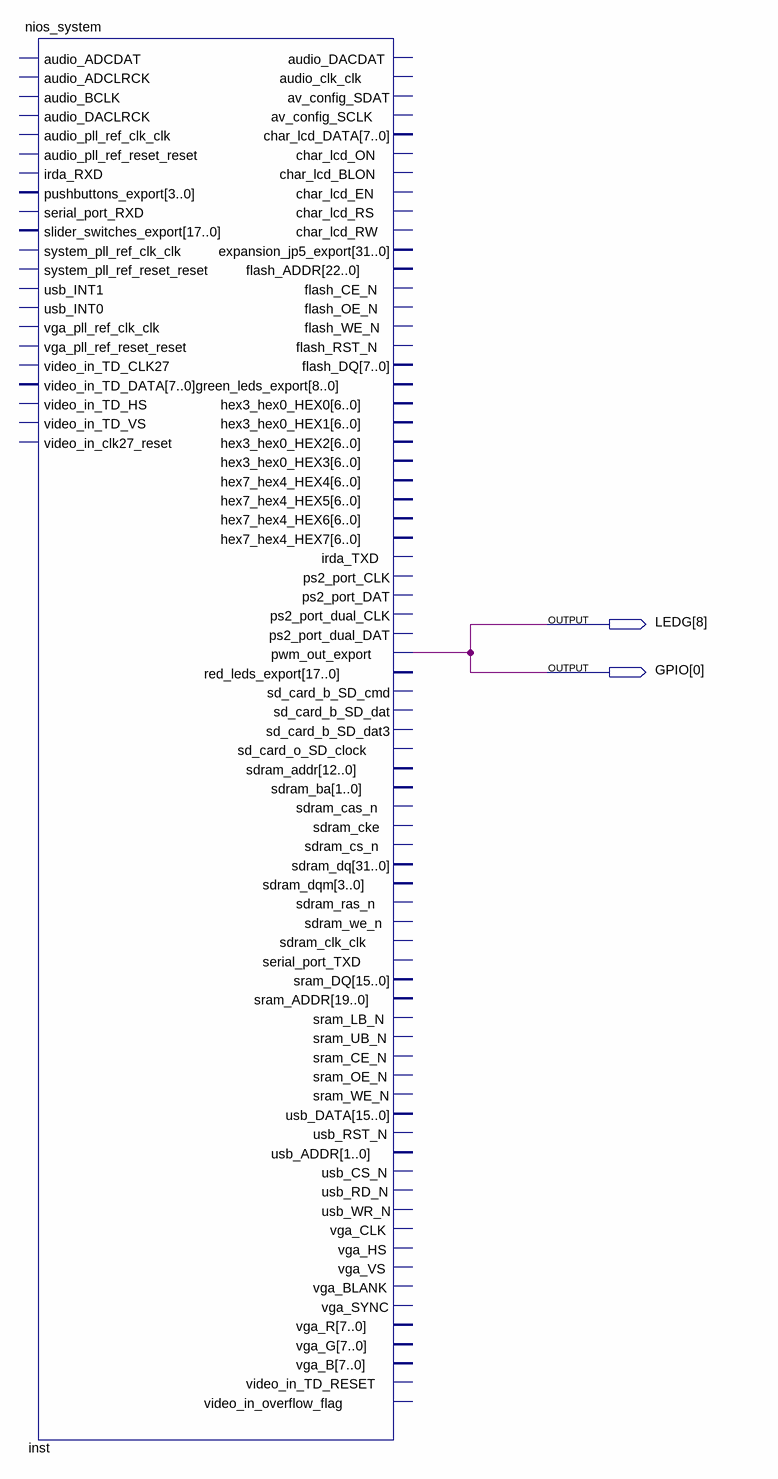
[diagram p0: schematic sheet]
// Quartus schematic PWM_media _computer.bdf as structural Verilog: 1 symbols, 2 pins
module \PWM_media__computer  (
  output [8:8] LEDG,
  output [0:0] GPIO
);

  nios_system inst (.pwm_out_export(GPIO[0]));  // open: audio_ADCDAT, audio_ADCLRCK, audio_BCLK, audio_DACLRCK, audio_pll_ref_clk_clk, audio_pll_ref_reset_reset, irda_RXD, pushbuttons_export, serial_port_RXD, slider_switches_export, system_pll_ref_clk_clk, system_pll_ref_reset_reset, usb_INT1, usb_INT0, vga_pll_ref_clk_clk, vga_pll_ref_reset_reset, video_in_TD_CLK27, video_in_TD_DATA, video_in_TD_HS, video_in_TD_VS, video_in_clk27_reset, audio_DACDAT, audio_clk_clk, av_config_SCLK, char_lcd_ON, char_lcd_BLON, char_lcd_EN, char_lcd_RS, char_lcd_RW, flash_ADDR, flash_CE_N, flash_OE_N, flash_WE_N, flash_RST_N, green_leds_export, hex3_hex0_HEX0, hex3_hex0_HEX1, hex3_hex0_HEX2, hex3_hex0_HEX3, hex7_hex4_HEX4, hex7_hex4_HEX5, hex7_hex4_HEX6, hex7_hex4_HEX7, irda_TXD, red_leds_export, sd_card_o_SD_clock, sdram_addr, sdram_ba, sdram_cas_n, sdram_cke, sdram_cs_n, sdram_dqm, sdram_ras_n, sdram_we_n, sdram_clk_clk, serial_port_TXD, sram_ADDR, sram_LB_N, sram_UB_N, sram_CE_N, sram_OE_N, sram_WE_N, usb_RST_N, usb_ADDR, usb_CS_N, usb_RD_N, usb_WR_N, vga_CLK, vga_HS, vga_VS, vga_BLANK, vga_SYNC, vga_R, vga_G, vga_B, video_in_TD_RESET, video_in_overflow_flag, av_config_SDAT, char_lcd_DATA, expansion_jp5_export, flash_DQ, ps2_port_CLK, ps2_port_DAT, ps2_port_dual_CLK, ps2_port_dual_DAT, sd_card_b_SD_cmd, sd_card_b_SD_dat, sd_card_b_SD_dat3, sdram_dq, sram_DQ, usb_DATA

  assign LEDG[8] = GPIO[0];
endmodule
